# EAGLE schematic ESP8266_firstBringup (EAGLE 7.3.0)
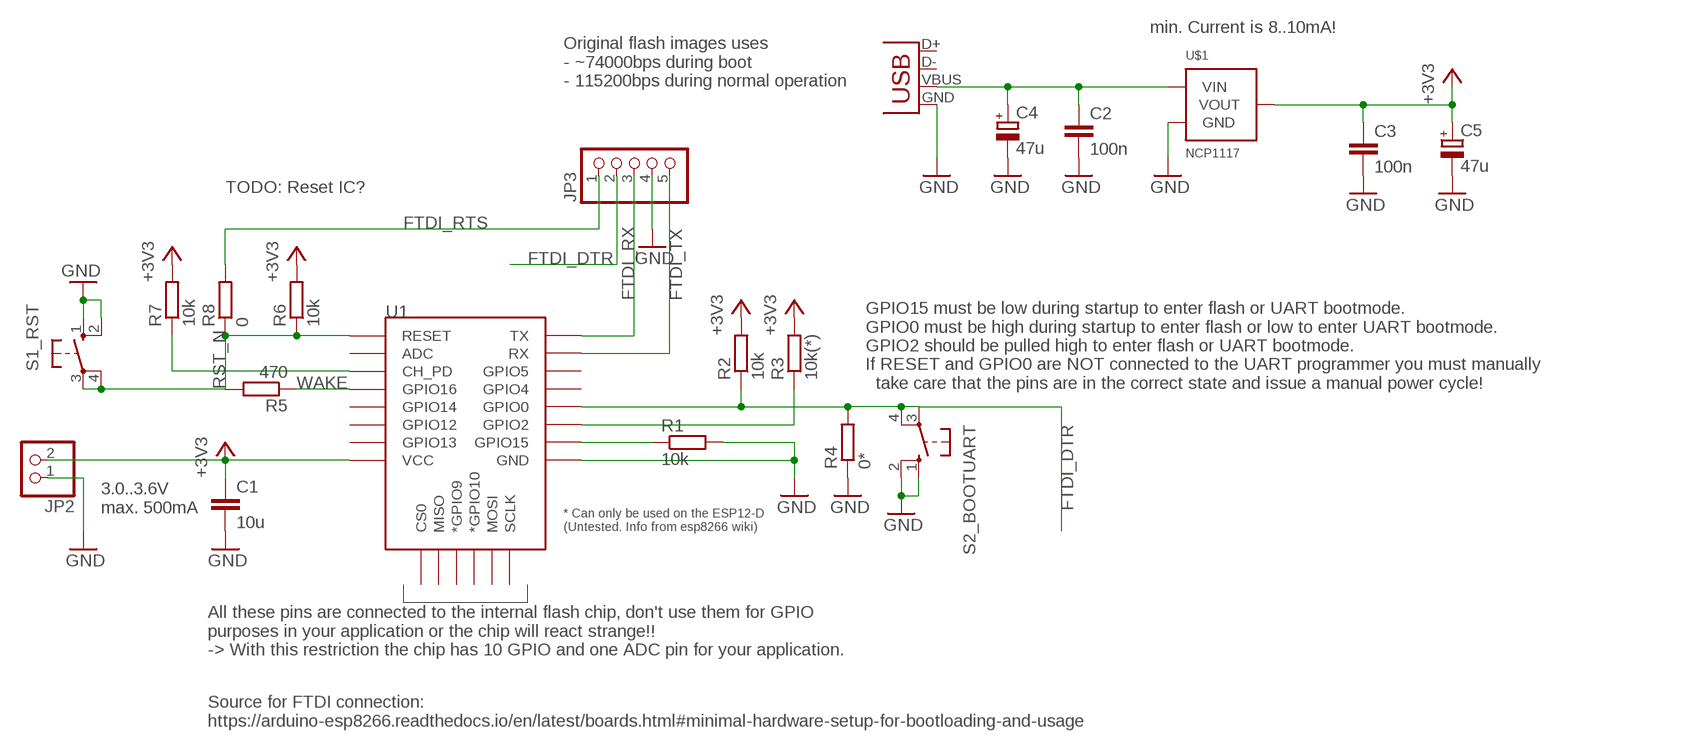
[diagram p0: schematic, sheet 1]

## Parts
C1  10u  C-EUC0805  [C0805]
C2  100n  C-EUC0603  [C0603]
C3  100n  C-EUC0603  [C0603]
C4  47u  CPOL-EUE2.5-6  [E2,5-6]
C5  47u  CPOL-EUE2.5-6  [E2,5-6]
JP2  PINHD-1X2  [1X02]
JP3  PINHD-1X5  [1X05]
R1  10k  R-EU_R0402  [R0402]
R2  10k  R-EU_R0402  [R0402]
R3  10k(*)  R-EU_R0402  [R0402]
R4  0*  R-EU_R0402  [R0402]
R5  470  R-EU_R0402  [R0402]
R6  10k  R-EU_R0402  [R0402]
R7  10k  R-EU_R0402  [R0402]
R8  0  R-EU_R0402  [R0402]
S1_RST  10-XX  [B3F-10XX]
S2_BOOTUART  10-XX  [B3F-10XX]
U1  ESP12ESMD  [ESP12E-SMD]
U$1  NCP1117  [SOT223]
X1  USBPTH  [USB-B-PTH]

## Nets
+3V3: C1.1 C3.1 C5.+ JP2.2 R2.2 R3.2 R6.2 R7.2 U1.VCC U$1.2(VOUT) U$1.4(VOUT)
FTDI_DTR: JP3.2 R2.1 R4.2 S2_BOOTUART.3(P) S2_BOOTUART.4(P1) U1.GPIO0
FTDI_RTS: JP3.1 R8.2
FTDI_RX: JP3.3 U1.TXD0(TX)
FTDI_TX: JP3.5 U1.RXD0(RX)
GND: C1.2 C2.2 C3.2 C4.- C5.- JP2.1 JP3.4 R1.2 R4.1 S1_RST.1(S) S1_RST.2(S1) S2_BOOTUART.1(S) S2_BOOTUART.2(S1) U1.GND U$1.1(GND) X1.GND
N$1: R1.1 U1.GPIO15
N$2: R3.1 U1.GPIO2
N$4: R7.1 U1.CH_PD
N$7: C2.1 C4.+ U$1.3(VIN) X1.VBUS
RST_N: R5.2 R6.1 R8.1 S1_RST.3(P) S1_RST.4(P1) U1.RESET
WAKE: R5.1 U1.GPIO16
Unconnected: U1.ADC U1.CS0 U1.GPIO4 U1.GPIO5 U1.GPIO9(*GPIO9) U1.GPIO10(*GPIO10) U1.GPIO12 U1.GPIO13 U1.GPIO14 U1.MISO U1.MOSI U1.SCLK X1.D+ X1.D-

## Notes on the sheet
- min. Current is 8..10mA!
- Original flash images uses
  - ~74000bps during boot
  - 115200bps during normal operation
- TODO: Reset IC?
- GPIO15 must be low during startup to enter flash or UART bootmode.
  GPIO0 must be high during startup to enter flash or low to enter UART bootmode.
  GPIO2 should be pulled high to enter flash or UART bootmode.
  If RESET and GPIO0 are NOT connected to the UART programmer you must manually
    take care that the pins are in the correct state and issue a manual power cycle!
- 3.0..3.6V
  max. 500mA
- All these pins are connected to the internal flash chip, don't use them for GPIO
  purposes in your application or the chip will react strange!!
  -> With this restriction the chip has 10 GPIO and one ADC pin for your application.
- Source for FTDI connection:
  https://arduino-esp8266.readthedocs.io/en/latest/boards.html#minimal-hardware-setup-for-bootloading-and-usage

## Library data of the parts
C1-C3 = rcl:C-EU: CAPACITOR, European symbol
C4 C5 = rcl:CPOL-EU: POLARIZED CAPACITOR, European symbol
JP2 = pinhead:PINHD-1X2: PIN HEADER
JP3 = pinhead:PINHD-1X5: PIN HEADER
R1-R8 = rcl:R-EU_: RESISTOR, European symbol
S1_RST S2_BOOTUART = switch-omron:10-XX: OMRON SWITCH; MPN: B3F-1000; OC_FARNELL: 176432; OC_NEWARK: 36M3542
U1 = esp8266modules:ESP12E: ESP12E Module
U$1 = Pinoccio:NCP1117: NCP1117 LDO Regulator
X1 = Pinoccio:USB: USB Connectors USB-B-PTH is fully proven SKU : PRT-00139 USB-miniB is fully proven SKU : PRT-00587 USB-A-PCB is untested. USB-A-H is throughly reviewed, but untested. Spark Fun Electronics SKU : PRT-00437 USB-B-SMT is throughly reviewed, but untested. Needs silkscreen touching up. USB-A-S has not been used/tested USB-MB-H has not been used/tested